# Altium schematic sheet BLOCK_DIAGRAM.SchDoc
size 594 x 420 mm; SheetNumber: 1; SheetTotal: 25
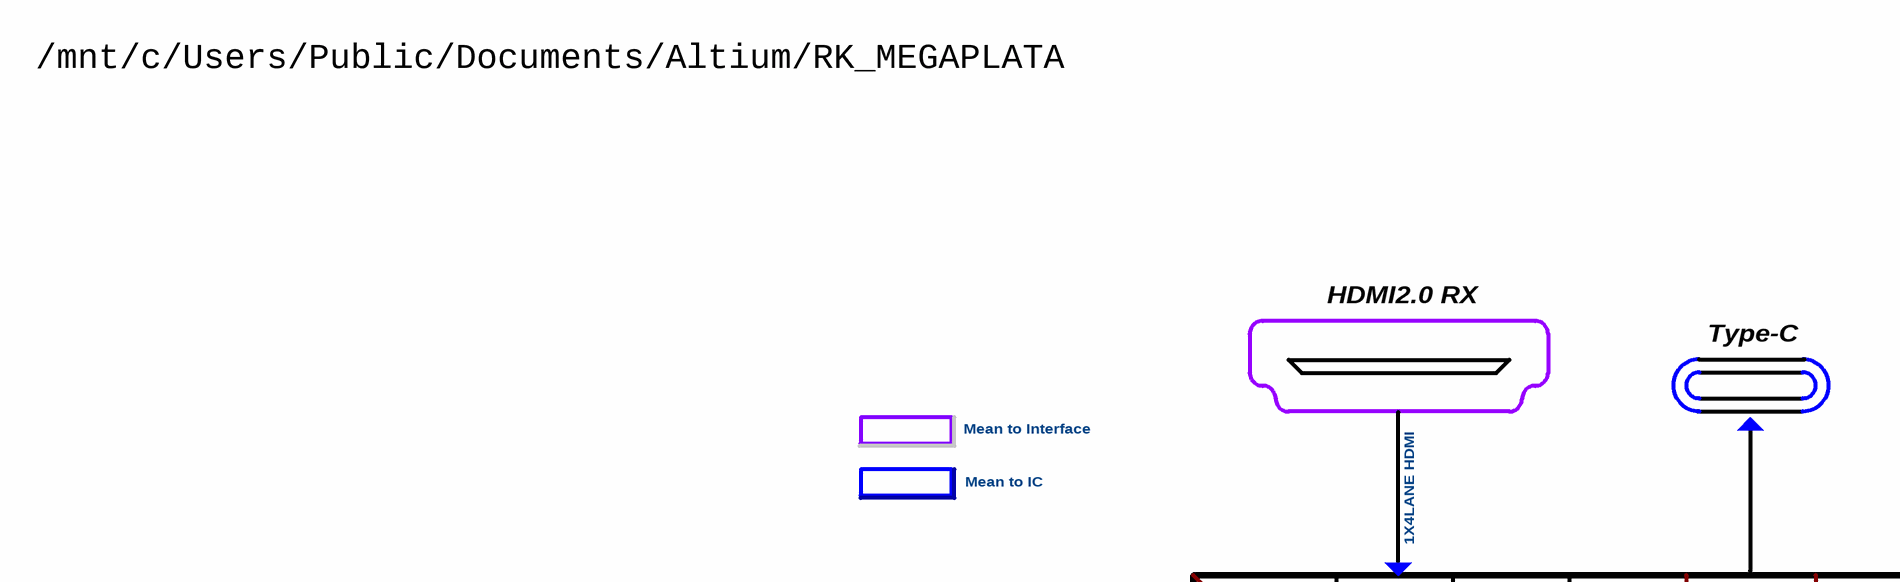
[diagram p0: BLOCK_DIAGRAM.SchDoc, top left]
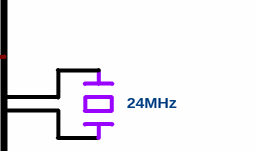
[diagram p1: BLOCK_DIAGRAM.SchDoc, top right]
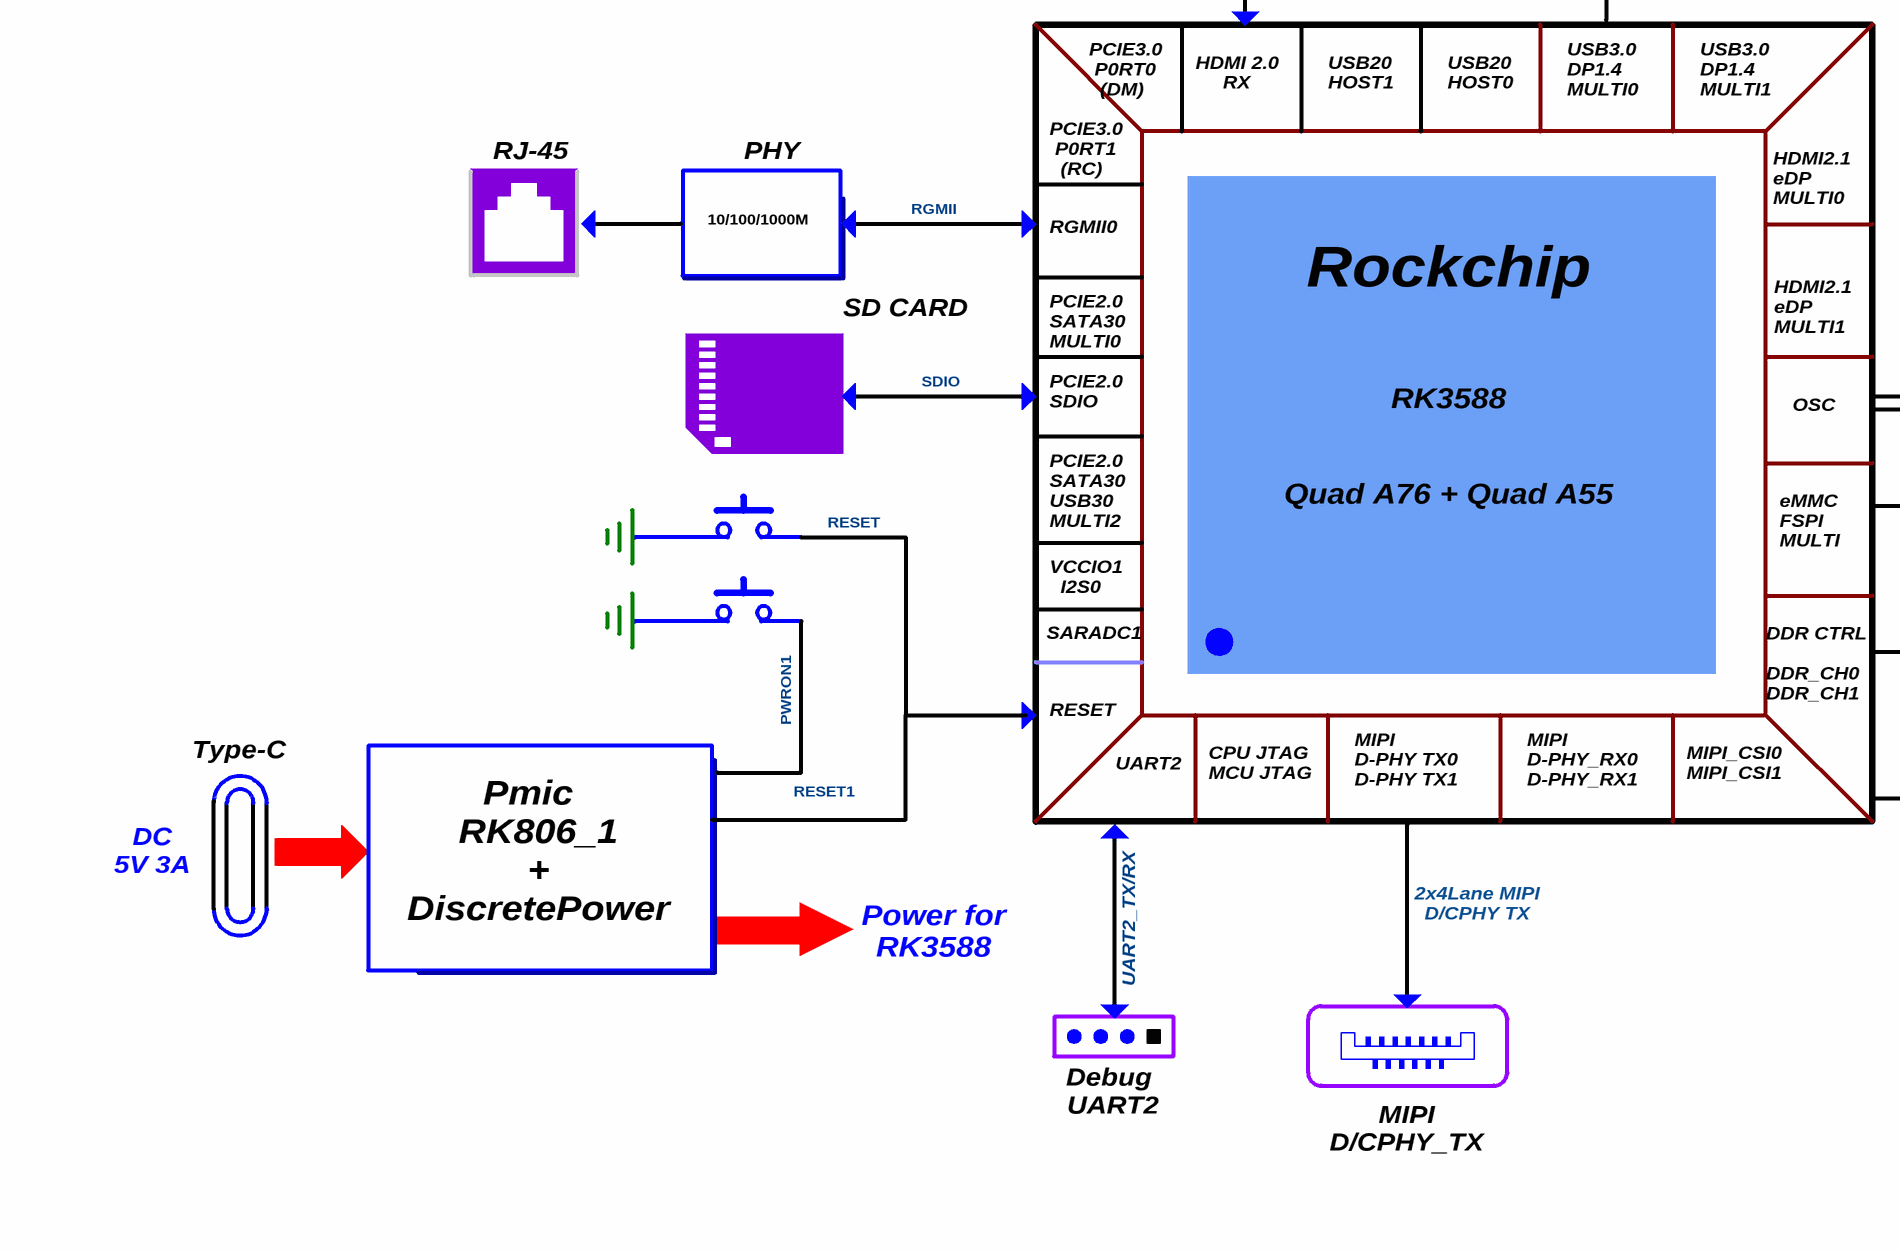
[diagram p2: BLOCK_DIAGRAM.SchDoc, bottom left]
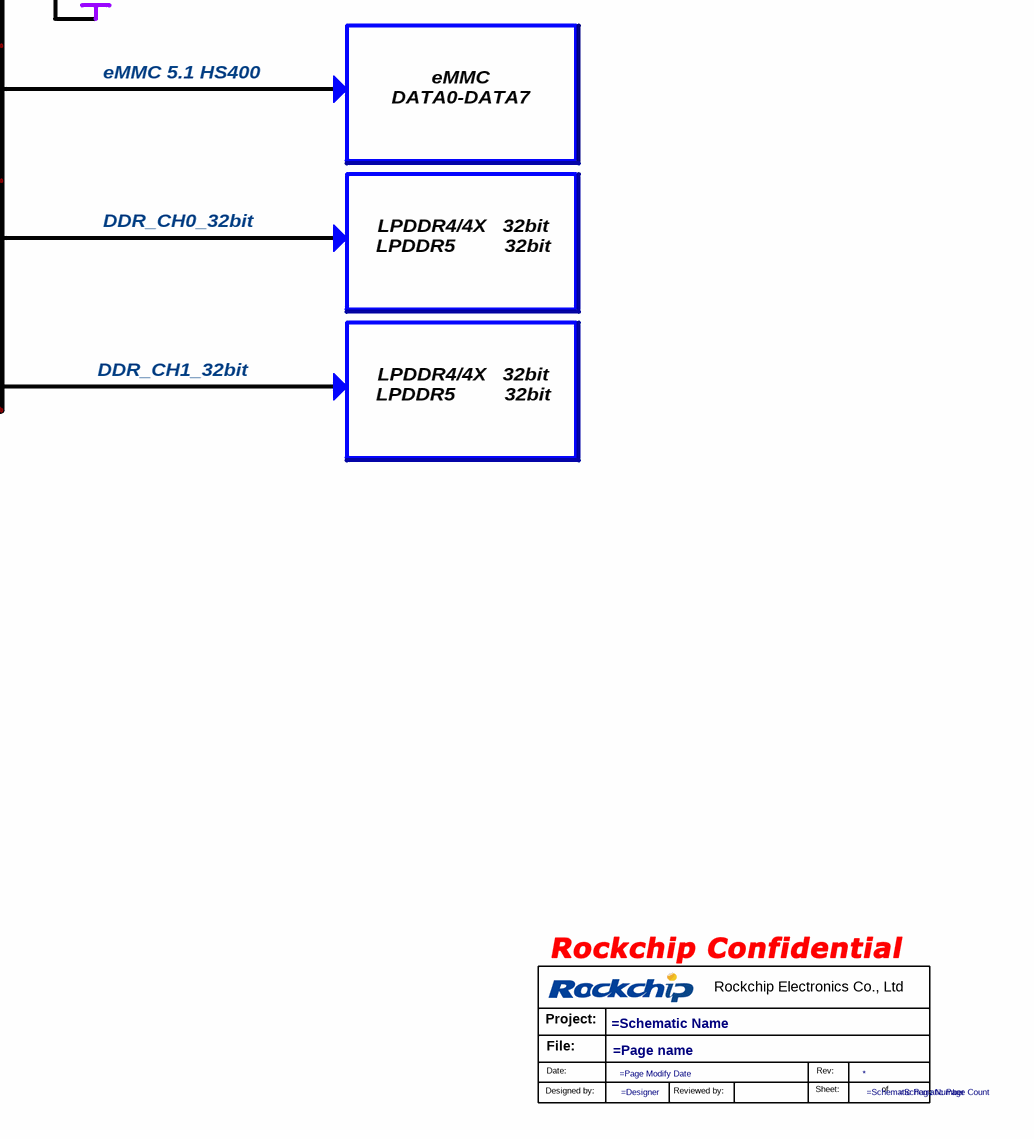
[diagram p3: BLOCK_DIAGRAM.SchDoc, bottom right]

## Parts
*?  (no value)  (graphical)

## Notes on the sheet
- /mnt/c/Users/Public/Documents/Altium/RK_MEGAPLATA
- HDMI2.0 RX
- Type-C
- Mean to Interface
- Mean to IC
- 1X4LANE HDMI
- HDMI 2.0
  RX
- USB20
  HOST1
- USB20
  HOST0
- USB3.0
  DP1.4
  MULTI0
- USB3.0
  DP1.4
  MULTI1
- RJ-45
- PHY
- PCIE3.0
  P0RT0
  (DM)
- 10/100/1000M
- RGMII
- PCIE3.0
  P0RT1
  (RC)
- HDMI2.1
  eDP
  MULTI0
- RGMII0
- SD CARD
- PCIE2.0
  SATA30
  MULTI0
- Rockchip
- HDMI2.1
  eDP
  MULTI1
- SDIO
- PCIE2.0
  SDIO
- OSC
- 24MHz
- eMMC 5.1 HS400
- RESET
- PCIE2.0
  SATA30
  USB30
  MULTI2
- RK3588
  Quad A76 + Quad A55
- eMMC
  FSPI
  MULTI
- eMMC
  DATA0-DATA7
- VCCIO1
  I2S0
- SARADC1
- DDR_CH0_32bit
- LPDDR4/4X   32bit
  LPDDR5         32bit
- PWRON1
- DDR CTRL
  DDR_CH0
  DDR_CH1
- RESET1
- UART2
- CPU JTAG
  MCU JTAG
- MIPI
  D-PHY TX0
  D-PHY TX1
- MIPI
  D-PHY_RX0
  D-PHY_RX1
- MIPI_CSI0
  MIPI_CSI1
- DDR_CH1_32bit
- DC
  5V 3A
- Pmic
  RK806_1
  +
  DiscretePower
- Power for RK3588
- 2x4Lane MIPI D/CPHY TX
- UART2_TX/RX
- Debug
  UART2
- MIPI
  D/CPHY_TX
- 420x594
- Формат А2
- (in symbol Rockchip_new) Rockchip Electronics Co., Ltd; Project:; File:; Date:; Rev:; Designed by:; Reviewed by:; Sheet:; of

## Library data of the parts
*? = Rockchip_new: Schematic Page Count: =Schematic Page Count; Schematic Page Number: =Schematic Page Number; Designer: =Designer; Page Modify Date: =Page Modify Date; Title: *; Revcode: =Revcode; Page name: =Page name; Schematic Name: =Schematic Name; Revision: *; Check: =Check; Page Count: =Page Count; Page Number: =Page Number; OrgAddr4: =OrgAddr4; OrgAddr3: =OrgAddr3; OrgAddr2: =OrgAddr2; OrgAddr1: =OrgAddr1; OrgName: =OrgName; Cage Code: =Cage Code; Doc: =Doc